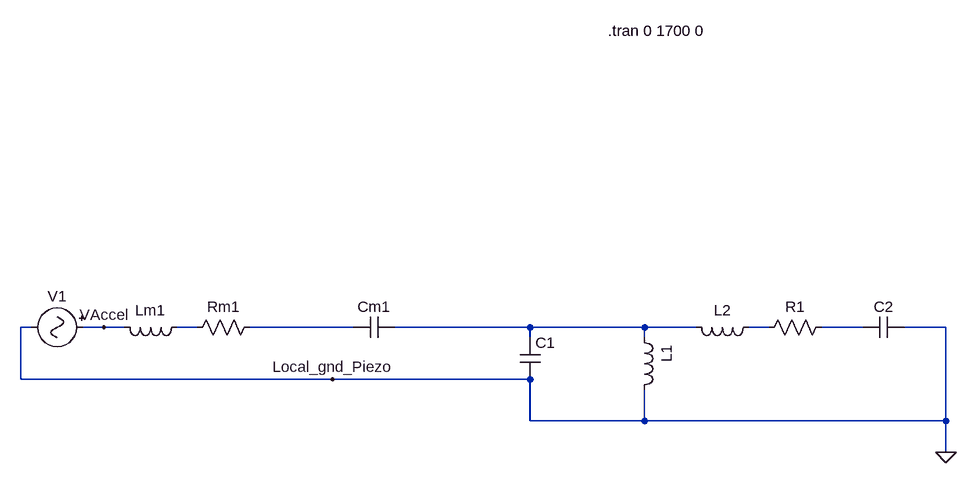
[diagram p0: schematic Piezo_Merc_W212_load_matched_idealPower.asc]
Piezo_Merc_W212_load_matched_idealPower.asc, the LTspice schematic file:
Version 4
SHEET 1 1176 1596
WIRE -288 0 -304 0
WIRE -176 0 -208 0
WIRE -144 0 -176 0
WIRE -32 0 -64 0
WIRE 208 0 48 0
WIRE 480 0 272 0
WIRE 656 0 480 0
WIRE 736 0 656 0
WIRE 848 0 816 0
WIRE 992 0 928 0
WIRE 1120 0 1056 0
WIRE 480 16 480 0
WIRE 656 16 656 0
WIRE -304 80 -304 0
WIRE 176 80 -304 80
WIRE 480 80 176 80
WIRE 480 144 480 80
WIRE 656 144 656 96
WIRE 656 144 480 144
WIRE 1120 144 1120 0
WIRE 1120 144 656 144
WIRE 1120 192 1120 144
FLAG -176 0 VAccel
FLAG 176 80 Local_gnd_Piezo
FLAG 1120 192 0
SYMBOL ind -48 -16 R90
WINDOW 0 5 56 VBottom 2
WINDOW 3 49 206 Invisible 2
SYMATTR InstName Lm1
SYMATTR Value 1.139e+5
SYMATTR SpiceLine Rser=0
SYMBOL res 64 -16 R90
WINDOW 0 0 56 VBottom 2
WINDOW 3 47 70 Invisible 2
SYMATTR InstName Rm1
SYMATTR Value 1.025e+5
SYMBOL cap 464 16 R0
WINDOW 3 24 56 Invisible 2
SYMATTR Value 22e-9
SYMATTR InstName C1
SYMBOL Misc\\signal -192 0 R90
WINDOW 0 -32 56 VBottom 2
WINDOW 3 46 70 Invisible 2
WINDOW 123 0 0 Left 0
WINDOW 39 0 0 Left 0
SYMATTR InstName V1
SYMATTR Value PWL file=D:\OneDrive\Master_Instrumentering_NTNU\Master_Thesis\Development\Accel_measurements\Scripts\MATLAB\Master\Accel\Datasets_for_LTSpice_simu\U857\Lars\accel-data-19-02-25--07_06_07_Y_axis-median-correctedsource_forU857_Full_dataset.txt
SYMBOL cap 272 -16 R90
WINDOW 0 0 32 VBottom 2
WINDOW 3 32 32 Invisible 2
SYMATTR InstName Cm1
SYMATTR Value 3.01e-9
SYMBOL ind 640 0 R0
WINDOW 0 50 54 VLeft 2
WINDOW 3 188 232 Invisible 2
SYMATTR InstName L1
SYMATTR Value 7.319600440376737e+03
SYMBOL ind 832 -16 R90
WINDOW 0 5 56 VBottom 2
WINDOW 3 46 70 Invisible 2
SYMATTR InstName L2
SYMATTR Value 1.139e+5
SYMBOL res 944 -16 R90
WINDOW 0 0 56 VBottom 2
WINDOW 3 46 70 Invisible 2
SYMATTR InstName R1
SYMATTR Value 1.025e+5
SYMBOL cap 1056 -16 R90
WINDOW 0 0 32 VBottom 2
WINDOW 3 47 46 Invisible 2
SYMATTR InstName C2
SYMATTR Value 3.011762400193772e-09
TEXT 600 -456 Left 2 !.tran 0 1700 0

The netlist it stands for:
* Piezo_Merc_W212_load_matched_idealPower.asc
Lm1 N001 VAccel 1.139e+5 Rser=0
Rm1 N002 N001 1.025e+5
C1 N003 0 22e-9
V1 VAccel 0 PWL file=D:\OneDrive\Master_Instrumentering_NTNU\Master_Thesis\Development\Accel_measurements\Scripts\MATLAB\Master\Accel\Datasets_for_LTSpice_simu\U857\Lars\accel-data-19-02-25--07_06_07_Y_axis-median-correctedsource_forU857_Full_dataset.txt
Cm1 N003 N002 3.01e-9
L1 N003 0 7.319600440376737e+03
L2 N004 N003 1.139e+5
R1 N005 N004 1.025e+5
C2 0 N005 3.011762400193772e-09
.tran 0 1700 0
.backanno
.end